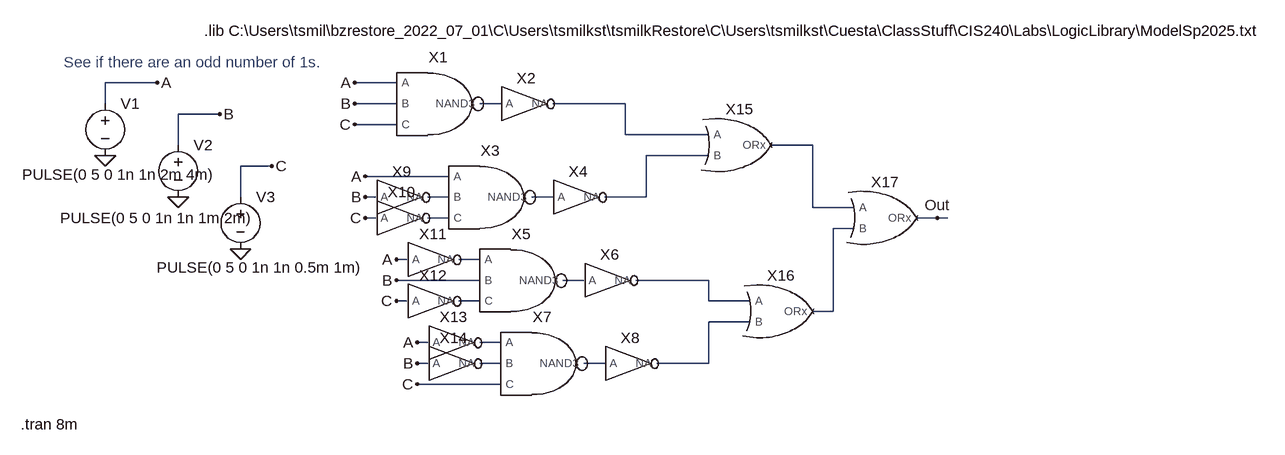
[diagram p0: schematic StartToFinish.asc]
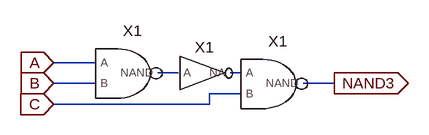
[diagram p1: sub-circuit nand3.asc]
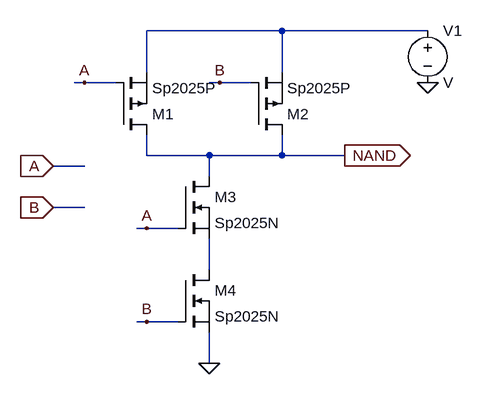
[diagram p2: sub-circuit nand.asc]
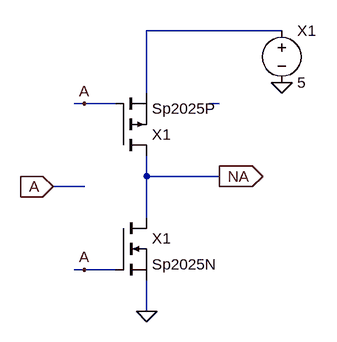
[diagram p3: sub-circuit invert.asc]
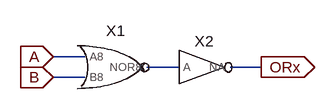
[diagram p4: sub-circuit orx.asc]
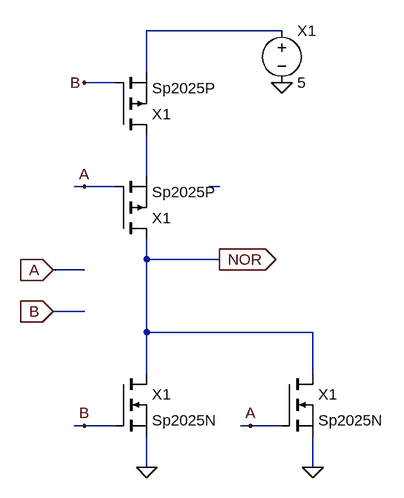
[diagram p5: sub-circuit nor.asc]
StartToFinish.asc, the LTspice schematic file:
Version 4.1.1
SHEET 1 1932 680
WIRE 0 48 -80 48
WIRE 368 48 304 48
WIRE -80 80 -80 48
WIRE 368 80 304 80
WIRE 528 80 496 80
WIRE 720 80 608 80
WIRE 96 96 32 96
WIRE 368 112 304 112
WIRE 720 128 720 80
WIRE 848 128 720 128
WIRE 32 144 32 96
WIRE 1008 144 944 144
WIRE 848 160 752 160
WIRE 176 176 128 176
WIRE 448 192 320 192
WIRE 128 224 128 176
WIRE 336 224 320 224
WIRE 448 224 416 224
WIRE 608 224 576 224
WIRE 752 224 752 160
WIRE 752 224 688 224
WIRE 1008 240 1008 144
WIRE 1072 240 1008 240
WIRE 336 256 320 256
WIRE 448 256 416 256
WIRE 1200 256 1168 256
WIRE 1216 256 1200 256
WIRE 1072 272 1040 272
WIRE 384 320 368 320
WIRE 496 320 464 320
WIRE 496 352 368 352
WIRE 656 352 624 352
WIRE 848 352 736 352
WIRE 384 384 368 384
WIRE 496 384 464 384
WIRE 848 384 848 352
WIRE 912 384 848 384
WIRE 1040 400 1040 272
WIRE 1040 400 1008 400
WIRE 912 416 848 416
WIRE 416 448 400 448
WIRE 528 448 496 448
WIRE 416 480 400 480
WIRE 528 480 496 480
WIRE 688 480 656 480
WIRE 848 480 848 416
WIRE 848 480 768 480
WIRE 528 512 400 512
FLAG 128 304 0
FLAG 32 224 0
FLAG -80 160 0
FLAG 0 48 A
FLAG 96 96 B
FLAG 176 176 C
FLAG 304 48 A
FLAG 304 80 B
FLAG 304 112 C
FLAG 320 192 A
FLAG 320 224 B
FLAG 320 256 C
FLAG 368 320 A
FLAG 368 352 B
FLAG 368 384 C
FLAG 400 448 A
FLAG 400 480 B
FLAG 400 512 C
FLAG 1200 256 Out
SYMBOL voltage -80 64 R0
WINDOW 3 -128 125 Left 2
WINDOW 123 0 0 Left 0
WINDOW 39 0 0 Left 0
SYMATTR InstName V1
SYMATTR Value PULSE(0 5 0 1n 1n 2m 4m)
SYMBOL voltage 32 128 R0
WINDOW 3 -181 128 Left 2
WINDOW 123 0 0 Left 0
WINDOW 39 0 0 Left 0
SYMATTR InstName V2
SYMATTR Value PULSE(0 5 0 1n 1n 1m 2m)
SYMBOL voltage 128 208 R0
WINDOW 3 -129 124 Left 2
WINDOW 123 0 0 Left 0
WINDOW 39 0 0 Left 0
SYMATTR InstName V3
SYMATTR Value PULSE(0 5 0 1n 1n 0.5m 1m)
SYMBOL NAND3 432 80 R0
SYMATTR InstName X1
SYMBOL INVERT 560 80 R0
SYMATTR InstName X2
SYMBOL NAND3 512 224 R0
SYMATTR InstName X3
SYMBOL INVERT 640 224 R0
SYMATTR InstName X4
SYMBOL NAND3 560 352 R0
SYMATTR InstName X5
SYMBOL INVERT 688 352 R0
SYMATTR InstName X6
SYMBOL NAND3 592 480 R0
SYMATTR InstName X7
SYMBOL INVERT 720 480 R0
SYMATTR InstName X8
SYMBOL INVERT 368 224 R0
SYMATTR InstName X9
SYMBOL INVERT 368 256 R0
SYMATTR InstName X10
SYMBOL INVERT 416 320 R0
SYMATTR InstName X11
SYMBOL INVERT 416 384 R0
SYMATTR InstName X12
SYMBOL INVERT 448 448 R0
SYMATTR InstName X13
SYMBOL INVERT 448 480 R0
SYMATTR InstName X14
SYMBOL ORx 896 144 R0
SYMATTR InstName X15
SYMBOL ORx 960 400 R0
SYMATTR InstName X16
SYMBOL ORx 1120 256 R0
SYMATTR InstName X17
TEXT -144 16 Left 2 ;See if there are an odd number of 1s.
TEXT 72 -32 Left 2 !.lib C:\\Users\\tsmil\\bzrestore_2022_07_01\\C\\Users\\tsmilkst\\tsmilkRestore\\C\\Users\\tsmilkst\\Cuesta\\ClassStuff\\CIS240\\Labs\\LogicLibrary\\ModelSp2025.txt
TEXT -210 574 Left 2 !.tran 8m

nand3.asc, the sub-circuit schematic file:
Version 4
SHEET 1 880 680
WIRE 80 80 16 80
WIRE 208 96 176 96
WIRE 304 96 288 96
WIRE 80 112 16 112
WIRE 448 112 400 112
WIRE 304 128 256 128
WIRE 256 144 256 128
WIRE 256 144 16 144
FLAG 16 80 A
IOPIN 16 80 In
FLAG 16 112 B
IOPIN 16 112 In
FLAG 16 144 C
IOPIN 16 144 In
FLAG 448 112 NAND3
IOPIN 448 112 Out
SYMBOL NAND 128 96 R0
SYMATTR InstName X1
SYMBOL NAND 352 112 R0
SYMATTR InstName X1
SYMBOL INVERT 240 96 R0
SYMATTR InstName X1

nand.asc, the sub-circuit schematic file:
Version 4
SHEET 1 880 680
.lib SHEET 1 880 680
WIRE 336 -160 128 -160
WIRE 560 -160 336 -160
WIRE 128 -96 128 -160
WIRE 336 -96 336 -160
WIRE 32 -80 16 -80
WIRE 80 -80 32 -80
WIRE 240 -80 224 -80
WIRE 288 -80 240 -80
WIRE 128 32 128 0
WIRE 224 32 128 32
WIRE 336 32 336 0
WIRE 336 32 224 32
WIRE 432 32 336 32
WIRE 32 48 -16 48
WIRE 224 64 224 32
WIRE 32 112 -16 112
WIRE 128 144 112 144
WIRE 176 144 128 144
WIRE 224 208 224 160
WIRE 128 288 112 288
WIRE 176 288 128 288
WIRE 224 352 224 304
FLAG 224 352 0
FLAG -16 48 A
IOPIN -16 48 In
FLAG -16 112 B
IOPIN -16 112 In
FLAG 128 144 A
FLAG 128 288 B
FLAG 32 -80 A
FLAG 240 -80 B
FLAG 432 32 NAND
IOPIN 432 32 Out
FLAG 560 -80 0
SYMBOL pmos 80 0 M180
SYMATTR InstName M1
SYMATTR Value Sp2025P
SYMBOL pmos 288 0 M180
SYMATTR InstName M2
SYMATTR Value Sp2025P
SYMBOL nmos 176 64 R0
SYMATTR InstName M3
SYMATTR Value Sp2025N
SYMBOL nmos 176 208 R0
SYMATTR InstName M4
SYMATTR Value Sp2025N
SYMBOL voltage 560 -176 R0
SYMATTR InstName V1

invert.asc, the sub-circuit schematic file:
Version 4
SHEET 1 880 680
WIRE 352 -80 144 -80
WIRE 144 16 144 -80
WIRE 48 32 32 32
WIRE 96 32 48 32
WIRE 256 32 240 32
WIRE 144 144 144 112
WIRE 256 144 144 144
WIRE 48 160 0 160
WIRE 144 208 144 144
WIRE 48 288 32 288
WIRE 96 288 48 288
WIRE 144 352 144 304
FLAG 144 352 0
FLAG 0 160 A
IOPIN 0 160 In
FLAG 48 288 A
FLAG 48 32 A
FLAG 256 144 NA
IOPIN 256 144 Out
FLAG 352 0 0
SYMBOL pmos 96 112 M180
SYMATTR InstName X1
SYMATTR Value Sp2025P
SYMBOL nmos 96 208 R0
SYMATTR InstName X1
SYMATTR Value Sp2025N
SYMBOL voltage 352 -96 R0
SYMATTR InstName X1
SYMATTR Value 5

orx.asc, the sub-circuit schematic file:
Version 4.1
SHEET 1 880 680
WIRE 112 128 64 128
WIRE 256 144 208 144
WIRE 384 144 336 144
WIRE 112 160 64 160
FLAG 64 128 A
IOPIN 64 128 In
FLAG 64 160 B
IOPIN 64 160 In
FLAG 384 144 ORx
IOPIN 384 144 Out
SYMBOL NOR 160 144 R0
SYMATTR InstName X1
SYMBOL INVERT 288 144 R0
SYMATTR InstName X2

nor.asc, the sub-circuit schematic file:
Version 4
SHEET 1 880 680
WIRE 432 -320 224 -320
WIRE 224 -256 224 -320
WIRE 176 -240 128 -240
WIRE 224 -96 224 -160
WIRE 128 -80 112 -80
WIRE 176 -80 128 -80
WIRE 336 -80 320 -80
WIRE 224 32 224 0
WIRE 336 32 224 32
WIRE 128 48 80 48
WIRE 128 112 80 112
WIRE 224 144 224 32
WIRE 480 144 224 144
WIRE 224 208 224 144
WIRE 480 208 480 144
WIRE 128 288 112 288
WIRE 176 288 128 288
WIRE 384 288 368 288
WIRE 432 288 384 288
WIRE 224 352 224 304
WIRE 480 352 480 304
FLAG 224 352 0
FLAG 80 48 A
IOPIN 80 48 In
FLAG 80 112 B
IOPIN 80 112 In
FLAG 384 288 A
FLAG 128 288 B
FLAG 128 -80 A
FLAG 128 -240 B
FLAG 336 32 NOR
IOPIN 336 32 Out
FLAG 480 352 0
FLAG 432 -240 0
SYMBOL pmos 176 0 M180
SYMATTR InstName X1
SYMATTR Value Sp2025P
SYMBOL pmos 176 -160 M180
SYMATTR InstName X1
SYMATTR Value Sp2025P
SYMBOL nmos 432 208 R0
SYMATTR InstName X1
SYMATTR Value Sp2025N
SYMBOL nmos 176 208 R0
SYMATTR InstName X1
SYMATTR Value Sp2025N
SYMBOL voltage 432 -336 R0
SYMATTR InstName X1
SYMATTR Value 5

The netlist it stands for:
* StartToFinish.asc
V1 A 0 PULSE(0 5 0 1n 1n 2m 4m)
V2 B 0 PULSE(0 5 0 1n 1n 1m 2m)
V3 C 0 PULSE(0 5 0 1n 1n 0.5m 1m)
XX1 A B C N001 nand3
XX2 N001 N002 invert
XX3 A N005 N007 N006 nand3
XX4 N006 N004 invert
XX5 N009 B N012 N010 nand3
XX6 N010 N011 invert
XX7 N014 N015 C N016 nand3
XX8 N016 N013 invert
XX9 B N005 invert
XX10 C N007 invert
XX11 A N009 invert
XX12 C N012 invert
XX13 A N014 invert
XX14 B N015 invert
XX15 N002 N004 N003 orx
XX16 N011 N013 N008 orx
XX17 N003 N008 Out orx

* block symbol definitions
.subckt nand3 A B C NAND3
XX1 A B N001 nand
XX1 N002 C NAND3 nand
XX1 N001 N002 invert
.ends nand3

.subckt nand A B NAND
M1 NAND A N001 N001 Sp2025P
M2 NAND B N001 N001 Sp2025P
M3 NAND A N002 N002 Sp2025N
M4 N002 B 0 0 Sp2025N
V1 N001 0 V
.ends nand

.subckt invert A NA
M§X1 NA A N001 N001 Sp2025P
M§X1 NA A 0 0 Sp2025N
V§X1 N001 0 5
.ends invert

.subckt orx A B ORx
X§X1 A B N001 nor
X§X2 N001 ORx invert
.ends orx

.subckt nor A8 B8 NOR8
M§X1 NOR A N002 N002 Sp2025P
M§X1 N002 B N001 N001 Sp2025P
M§X1 NOR A 0 0 Sp2025N
M§X1 NOR B 0 0 Sp2025N
V§X1 N001 0 5
.ends nor

.model NMOS NMOS
.model PMOS PMOS
.lib standard.mos
* See if there are an odd number of 1s.
.lib C:\Users\tsmil\bzrestore_2022_07_01\C\Users\tsmilkst\tsmilkRestore\C\Users\tsmilkst\Cuesta\ClassStuff\CIS240\Labs\LogicLibrary\ModelSp2025.txt
.tran 8m
.backanno
.end